# Altium project PCB_Project.PrjPCB
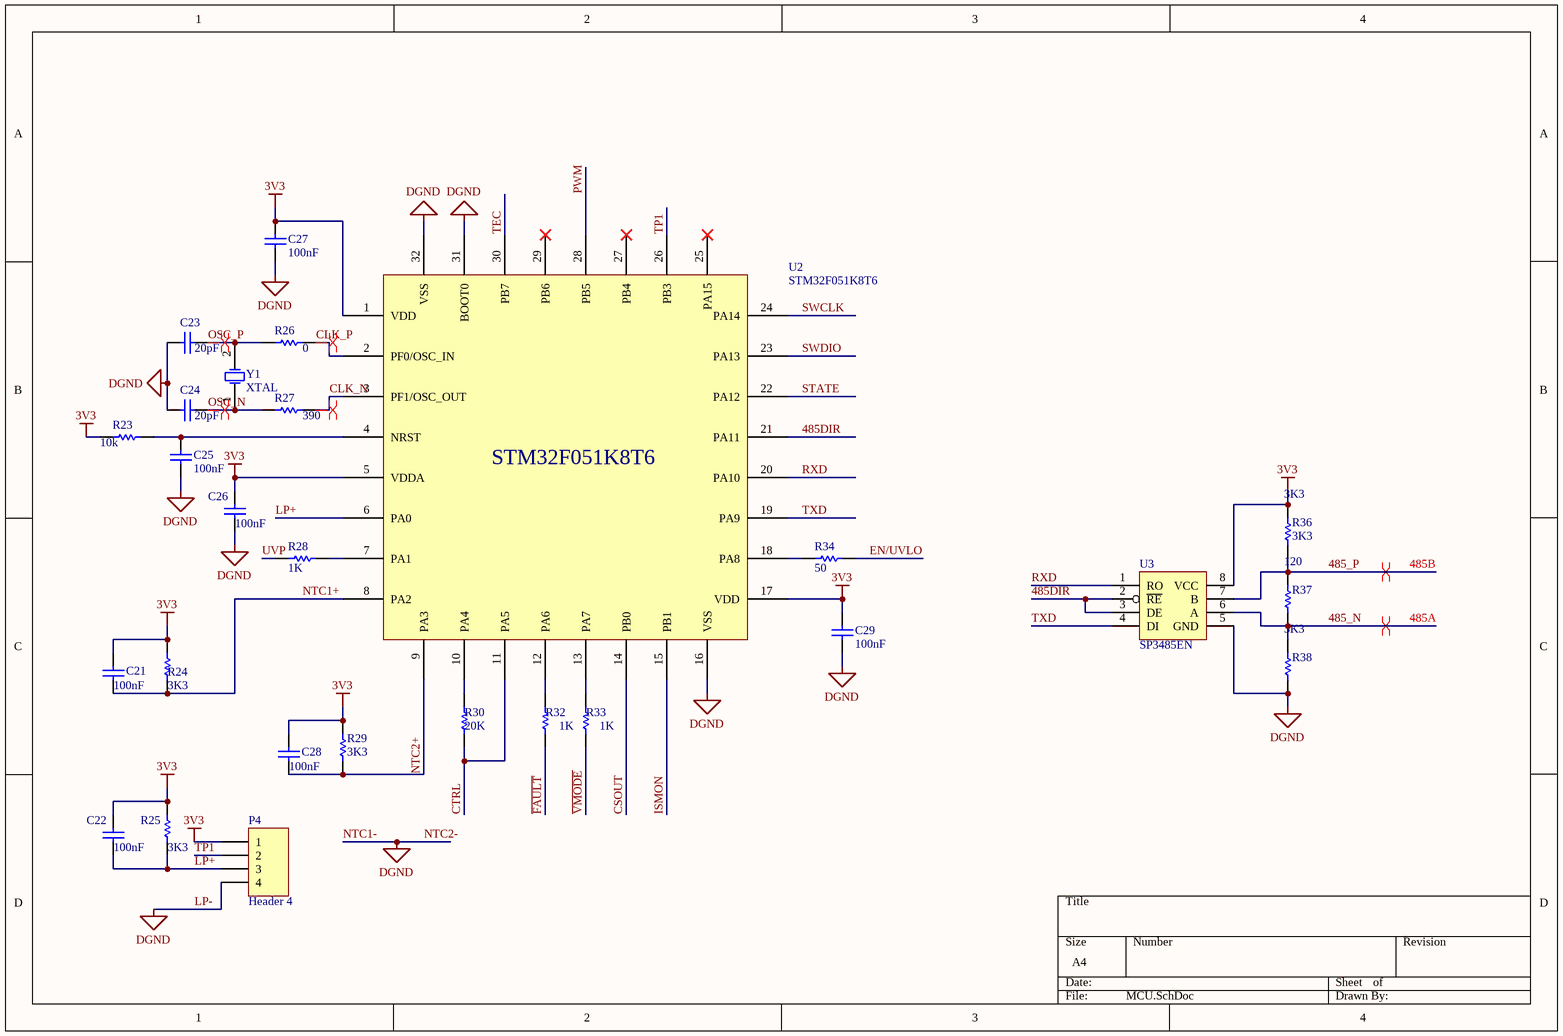
[diagram p0: MCU.SchDoc]
3 sheets, 69 parts. Net scope: global (net labels, ports and power ports of the same name join across sheets).
Board file: 红蓝光PCB.PcbDoc
Sheets:
  MCU.SchDoc
  PWR.SchDoc
  3796.SchDoc

## Sheet MCU.SchDoc
size A4

### Parts
C21  100nF  [1608[0603]]
C22  100nF  [1608[0603]]
C23  20pF  [1608[0603]]
C24  20pF  [1608[0603]]
C25  100nF  [1608[0603]]
C26  100nF  [1608[0603]]
C27  100nF  [1608[0603]]
C28  100nF  [1608[0603]]
C29  100nF  [1608[0603]]
P4  Header 4  [HDR1X4]
R23  10k  [1608[0603]]
R24  3K3  [1608[0603]]
R25  3K3  [1608[0603]]
R26  0  [1608[0603]]
R27  390  [1608[0603]]
R28  1K  [1608[0603]]
R29  3K3  [1608[0603]]
R30  20K  [1608[0603]]
R32  1K  [1608[0603]]
R33  1K  [1608[0603]]
R34  50  [1608[0603]]
R36  3K3  [1608[0603]]
R37  120  [1608[0603]]
R38  3K3  [1608[0603]]
U2  STM32F051K8T6  [TQFP80P900X900X160-32N]
U3  SP3485EN  [SOIC127P600-8N]
Y1  XTAL  [XTAL_SMT]

### Nets
3V3: C21.1 C22.1 C26.1 C27.2 C28.1 C29.2 P4.1 R23.2 R24.1 R25.1 R29.1 R36.2 U2.1(VDD) U2.5(VDDA) U2.17(VDD) U3.8(VCC)
LP-: C23.2 C24.2 C25.1 C26.2 C27.1 C29.1 P4.4 R38.1 U2.16(VSS) U2.31(BOOT0) U2.32(VSS) U3.5(GND)  [also labelled DGND, NTC1-, NTC2-]
485_N: R37.1 R38.2 U3.6(A)  [also labelled 485A]
485_P: R36.1 R37.2 U3.7(B)  [also labelled 485B]
485DIR: U2.21(PA11) U3.2(~{RE}) U3.3(DE)
CLK_N: R27.2 U2.3(PF1/OSC_OUT)
CLK_P: R26.2 U2.2(PF0/OSC_IN)
CSOUT: U2.14(PB0)
CTRL: R30.2 U2.11(PA5)
EN/UVLO: R34.2
~{FAULT}: R32.2
ISMON: U2.15(PB1)
LP+: C22.2 P4.3 R25.2 U2.6(PA0)
NTC1+: C21.2 R24.2 U2.8(PA2)
NTC2+: C28.2 R29.2 U2.9(PA3)
OSC_N: C24.1 R27.1 Y1.1(OSC1)
OSC_P: C23.1 R26.1 Y1.2(OSC2)
PWM: U2.28(PB5)
RXD: U2.20(PA10) U3.1(RO)
STATE: U2.22(PA12)
SWCLK: U2.24(PA14)
SWDIO: U2.23(PA13)
TEC: U2.30(PB7)
TP1: P4.2 U2.26(PB3)
TXD: U2.19(PA9) U3.4(DI)
UVP: R28.1
~{VMODE}: R33.2
NetC25_2: C25.2 R23.1 U2.4(NRST)
NetR28_2: R28.2 U2.7(PA1)
NetR30_1: R30.1 U2.10(PA4)
NetR32_1: R32.1 U2.12(PA6)
NetR33_1: R33.1 U2.13(PA7)
NetR34_1: R34.1 U2.18(PA8)

Not connected (* = marked no-connect by the designer): U2 25(PA15)* 27(PB4)* 29(PB6)*

### Layout directives
differential pair: 485_N, 485_P, CLK_N, CLK_P, OSC_N, OSC_P

### Library data of the parts
C21-C29 = Cap: Capacitor; Published: 8-Jun-2000; LatestRevisionDate: 17-Jul-2002; LatestRevisionNote: Re-released for DXP Platform.; PackageReference: RAD-0.3; Publisher: Altium Limited; PackageDescription: Radial Cap, Thru-Hole; 2 Leads; 0.3 in Pin Spacing
  C21 C22 C25-C29: Value: 100nF
  C23 C24: Value: 20pF
P4 = Header 4: Header, 4-Pin; LatestRevisionDate: 17-Jul-2002; LatestRevisionNote: Re-released for DXP Platform.; Publisher: Altium Limited
R23-R30 R32-R34 R36-R38 = Res1: Resistor; Published: 8-Jun-2000; LatestRevisionDate: 17-Jul-2002; LatestRevisionNote: Re-released for DXP Platform.; PackageReference: AXIAL-0.3; Publisher: Altium Limited; PackageDescription: Axial Device, Thru-Hole; 2 Leads; 0.3 in Pin Spacing
  R23: Value: 10K
  R24 R25 R29 R36 R38: Value: 3K3
  R26: Value: 0
  R27: Value: 390
  R28 R32 R33: Value: 1k
  R30: Value: 20K
  R34: Value: 50
  R37: Value: 120
U2 = MCU_STM32F051K8T6: Low- and medium-density advanced ARM?-based 32-bit MCU with  16 to 64 Kbytes Flash, timers, ADC, DAC and comm. interfaces
U3 = LGC_RS485: Low-Power, Slew-Rate-Limited  RS-485/RS-422 Transceivers
Y1 = XTAL: Crystal Oscillator; Published: 8-Jun-2000; LatestRevisionDate: 17-Jul-2002; LatestRevisionNote: Re-released for DXP Platform.; PackageReference: R38; Publisher: Altium Limited; PackageDescription: Crystal, Thru-Hole; 2 Leads; Body 3.1 x 8.2 mm (Dia.xH)

## Sheet PWR.SchDoc
size A4
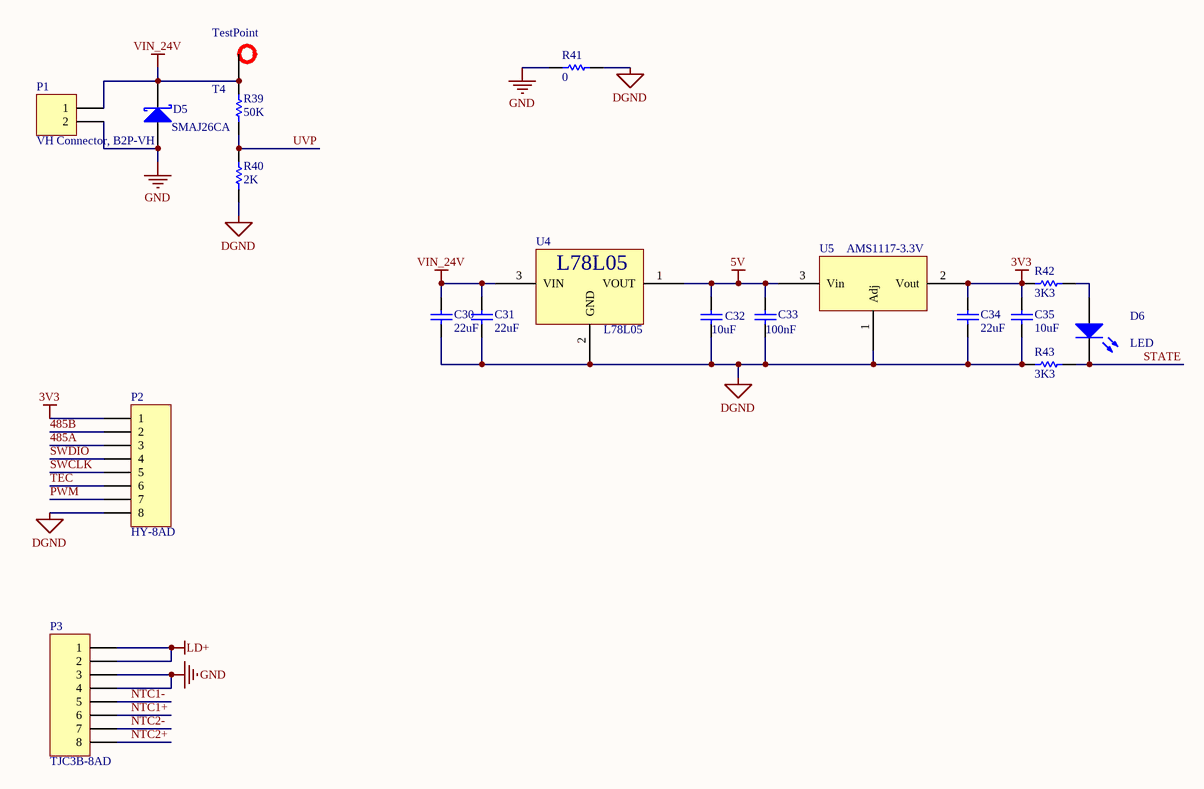
[diagram p1: PWR.SchDoc]

### Parts
C30  22uF  [1608[0603]]
C31  22uF  [1608[0603]]
C32  10uF  [1608[0603]]
C33  100nF  [1608[0603]]
C34  22uF  [1608[0603]]
C35  10uF  [1608[0603]]
D5  SMAJ26CA  [SMA_DIOM5226X26N]
D6  LED  [2012[0805] - LED]
P1  VH Connector, B2P-VH  [2PIN-B2P_VH]
P2  HY-8AD  [8P -HY-8AD]
P3  TJC3B-8AD  [8P-TJC3B8AD]
R39  50K  [1608[0603]]
R40  2K  [1608[0603]]
R41  0  [2012[0805]]
R42  3K3  [1608[0603]]
R43  3K3  [1608[0603]]
T4  Test Point  [TestPoint]  (value not drawn)
U4  L78L05  [SOT89-150P410X160-3N]
U5  AMS1117-3.3V  [SOT89-150P410X160-3N]

### Nets
3V3: C34.2 C35.2 P2.1 R42.2 U5.2(Vout)
5V: C32.2 C33.2 U4.1(VOUT) U5.3(Vin)
DGND: C30.1 C31.1 C32.1 C33.1 C34.1 C35.1 P2.8 P3.5 P3.7 R40.2 R41.1 R43.2 U4.2(GND) U5.1(Adj)  [also labelled NTC1-, NTC2-]  [project net LP-]
GND: D5.1(A) P1.2 P3.3 P3.4 R41.2
LD+: P3.1 P3.2
VIN_24V: C30.2 C31.2 D5.2(K) P1.1 R39.1 T4.1(TP) U4.3(VIN)  [project net CS_P]
485A: P2.3  [project net 485_N]
485B: P2.2  [project net 485_P]
NTC1+: P3.6
NTC2+: P3.8
PWM: P2.7
STATE: D6.2(K) R43.1
SWCLK: P2.5
SWDIO: P2.4
TEC: P2.6
UVP: R39.2 R40.1
NetD6_1: D6.1(A) R42.1

### Notes on the sheet
- (in symbol TP) TestPoint

### Library data of the parts
C30-C35 = Cap: Capacitor; Published: 8-Jun-2000; LatestRevisionDate: 17-Jul-2002; LatestRevisionNote: Re-released for DXP Platform.; PackageReference: RAD-0.3; Publisher: Altium Limited; PackageDescription: Radial Cap, Thru-Hole; 2 Leads; 0.3 in Pin Spacing
  C30 C31 C34: Value: 22uF
  C32 C35: Value: 10uF
  C33: Value: 100nF
D5 = D Schottky: Schottky Diode; Published: 8-Jun-2000; LatestRevisionDate: 17-Jul-2002; LatestRevisionNote: Re-released for DXP Platform.; PackageReference: SMB; Publisher: Altium Limited; PackageDescription: DO-214-AA/SMB; 2 C-Bend Leads; Body 5.3 x 3.6 mm, inc. leads (LxW); Code_JEDEC: DO-214-AA
D6 = LED0: Typical INFRARED GaAs LED; Published: 8-Jun-2000; LatestRevisionDate: 08-Jul-2005; LatestRevisionNote: Mech Layer 1 removed.; PackageReference: LED-0; Publisher: Altium Limited; PackageDescription: LED; 2 Leads
P1 = Header 2: Header, 2-Pin; LatestRevisionDate: 17-Jul-2002; LatestRevisionNote: Re-released for DXP Platform.; Publisher: Altium Limited
P2 P3 = Header 8: Header, 8-Pin; LatestRevisionDate: 17-Jul-2002; LatestRevisionNote: Re-released for DXP Platform.; Publisher: Altium Limited
R39-R43 = Res1: Resistor; Published: 8-Jun-2000; LatestRevisionDate: 17-Jul-2002; LatestRevisionNote: Re-released for DXP Platform.; PackageReference: AXIAL-0.3; Publisher: Altium Limited; PackageDescription: Axial Device, Thru-Hole; 2 Leads; 0.3 in Pin Spacing
  R39: Value: 50k
  R40: Value: 2K
  R41: Value: 0
  R42 R43: Value: 3K3
T4 = TP
U4 = PWR_L78L05: POSITIVE VOLTAGE REGULATORS
U5 = PWR_LM1XXX: 5V转3V3 10mA  DC/DC

## Sheet 3796.SchDoc
size A4
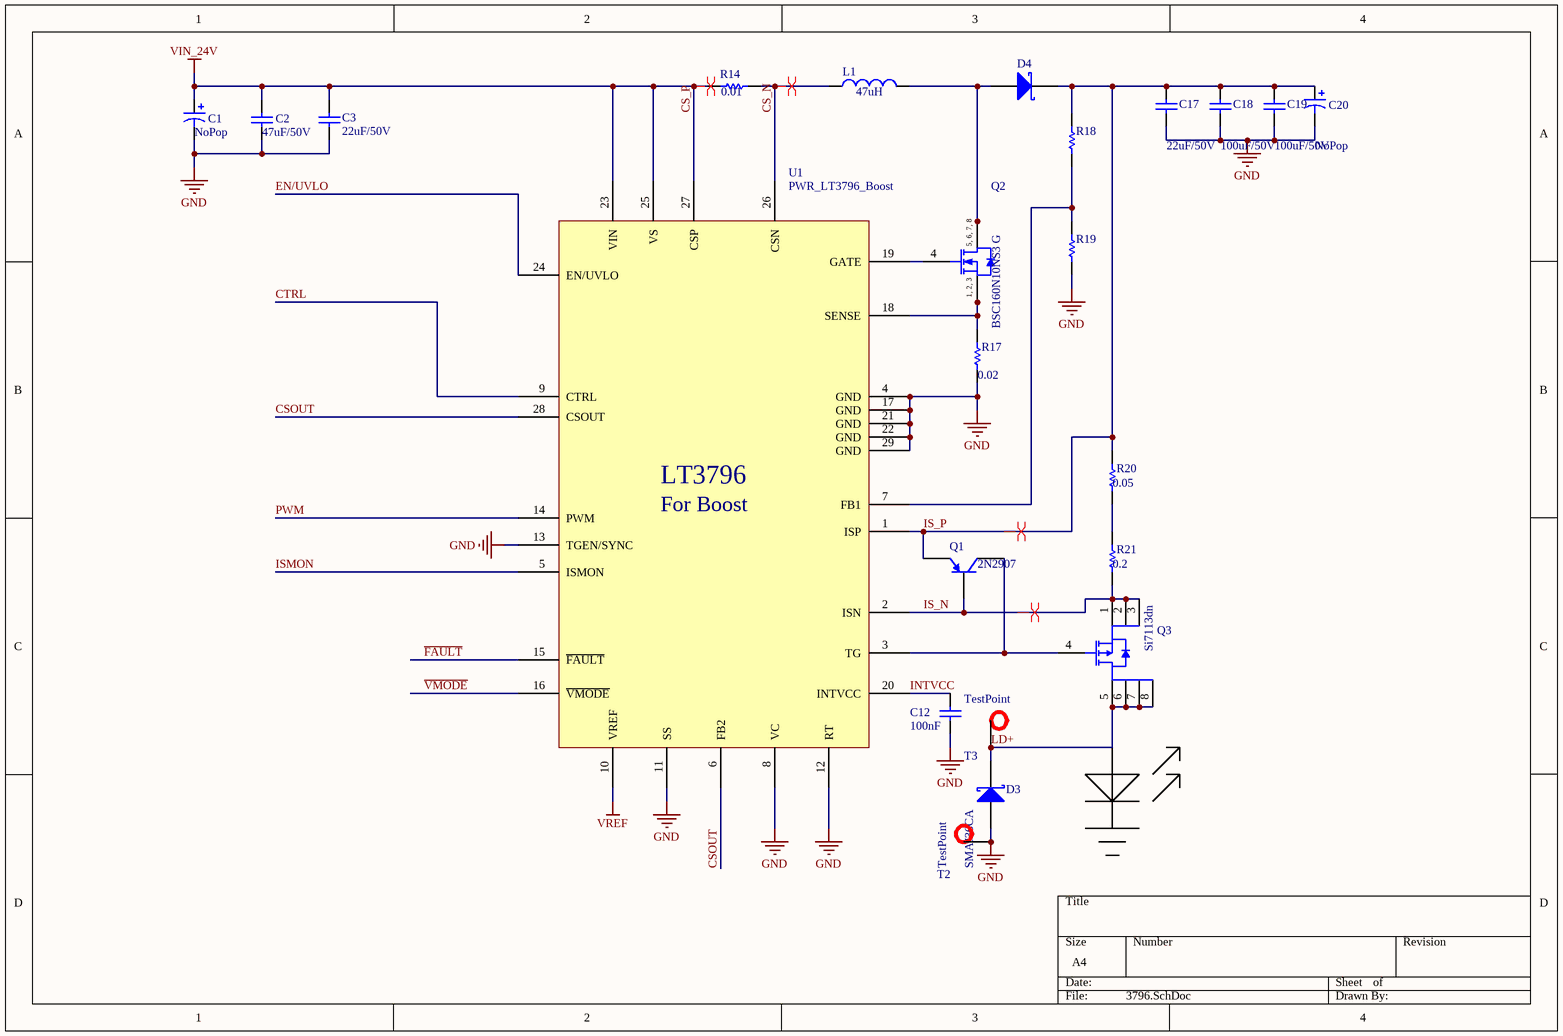
[diagram p2: 3796.SchDoc]

### Parts
C1  NoPop  [SMC_Altium Capacity 8*10]
C2  47uF/50V  [1206[3216] - NP]
C3  22uF/50V  [1206[3216] - NP]
C12  100nF  [1608[0603]]
C17  22uF/50V  [1206[3216] - NP]
C18  100uF/50V  [1206[3216] - NP]
C19  100uF/50V  [1206[3216] - NP]
C20  NoPop  [SMC_Altium Capacity 8*10]
D3  SMAJ36CA  [SMA_DIOM5226X26N]
D4  (no value)  [PowerDI5]
L1  value 47uH  [IHLP4040]  (hidden comment: IHLP-4040DZ-11)
Q1  2N2907  [SOT95P280X115-3N]
Q2  BSC160N10NS3 G  [INF-PG-TDSON-8-1_V]
Q3  Si7113dn  [1212-8 Single]
R14  0.01  [2512[6432]]
R17  0.02  [2512[6432]]
R18  (no value)  [1608[0603]]
R19  (no value)  [1608[0603]]
R20  0.05  [2512[6432]]
R21  0.2  [2512[6432]]
T2  Test Point  [TestPoint]  (value not drawn)
T3  Test Point  [TestPoint]  (value not drawn)
U1  PWR_LT3796_Boost  [TSOP65P640X120_HS-29N]

### Nets
CS_P: C1.1 C2.2 C3.2 R14.1 U1.23(VIN) U1.25(VS) U1.27(CSP)  [also labelled VIN_24V]
GND: C1.2 C2.1 C3.1 C12.2 C17.1 C18.1 C19.1 C20.2 D3.1(A) R17.1 R19.2 T2.1(TP) U1.4(GND) U1.8(VC) U1.11(SS) U1.12(RT) U1.13(TGEN/SYNC) U1.17(GND) U1.21(GND) U1.22(GND) U1.29(GND)
LD+: D3.2(K) Q3.5(DRAIN) Q3.6(DRAIN) Q3.7(DRAIN) Q3.8(DRAIN) T3.1(TP)
VREF: U1.10(VREF)
CS_N: L1.1 R14.2 U1.26(CSN)
CSOUT: U1.6(FB2) U1.28(CSOUT)
CTRL: U1.9(CTRL)
EN/UVLO: U1.24(EN/UVLO)
~{FAULT}: U1.15(~{FAULT})
INTVCC: C12.1 U1.20(INTVCC)
IS_N: Q1.2(B) Q3.1(SOURCE) Q3.2(SOURCE) Q3.3(SOURCE) R21.1 U1.2(ISN)
IS_P: C17.2 C18.2 C19.2 C20.1 D4.2(K) Q1.1(E) R18.2 R20.2 U1.1(ISP)
ISMON: U1.5(ISMON)
PWM: U1.14(PWM)
~{VMODE}: U1.16(~{VMODE})
NetD4_1: D4.1(A) L1.2 Q2.5(DRAIN) Q2.6(DRAIN) Q2.7(DRAIN) Q2.8(DRAIN)
NetQ1_3: Q1.3(C) Q3.4(GATE) U1.3(TG)
NetQ2_1: Q2.1(SOURCE) Q2.2(SOURCE) Q2.3(SOURCE) R17.2 U1.18(SENSE)
NetQ2_4: Q2.4(GATE) U1.19(GATE)
NetR18_1: R18.1 R19.1 U1.7(FB1)
NetR20_1: R20.1 R21.2

### Layout directives
differential pair: CS_N, CS_P, IS_N, IS_P

### Notes on the sheet
- (in symbol BSC160N10NS3 G) 5, 6, 7, 8; 1, 2, 3
- (in symbol PWR_LT3796_Boost) LT3796; For Boost
- (in symbol TP) TestPoint

### Library data of the parts
C1 C20 = Cap Pol1: Polarized Capacitor (Radial); Value: 100uF/50V; Published: 8-Jun-2000; LatestRevisionDate: 17-Jul-2002; LatestRevisionNote: Re-released for DXP Platform.; PackageReference: RB7.6-15; Publisher: Altium Limited; PackageDescription: Polarized Capacitor (Radial); 2 Leads
C2 C3 C12 C17-C19 = Cap: Capacitor; Published: 8-Jun-2000; LatestRevisionDate: 17-Jul-2002; LatestRevisionNote: Re-released for DXP Platform.; PackageReference: RAD-0.3; Publisher: Altium Limited; PackageDescription: Radial Cap, Thru-Hole; 2 Leads; 0.3 in Pin Spacing
  C2: Value: 47uF/50V
  C3 C17: Value: 22uF/50V
  C12: Value: 100nF
  C18 C19: Value: 100uF/50V
D3 D4 = D Schottky: Schottky Diode; Published: 8-Jun-2000; LatestRevisionDate: 17-Jul-2002; LatestRevisionNote: Re-released for DXP Platform.; PackageReference: SMB; Publisher: Altium Limited; PackageDescription: DO-214-AA/SMB; 2 C-Bend Leads; Body 5.3 x 3.6 mm, inc. leads (LxW); Code_JEDEC: DO-214-AA
L1 = Inductor: Code_IEC: 1005; Published: 8-Jun-2000; LatestRevisionDate: 29-May-2009; LatestRevisionNote: IPC-7351 Footprint Added.; PackageReference: 0402-A; Publisher: Altium Limited; PackageDescription: Chip Inductor; Code_JEITA: 0402
Q1 = 2N3906: PNP General Purpose Amplifier; Published: 8-Jun-2000; LatestRevisionDate: 15-Jan-2003; LatestRevisionNote: PCB Footprint 'BCY-W3/D4.7' replaced; DatasheetVersion: 1997; PackageVersion: Sep-1998; PackageReference: TO-92A; Publisher: Altium Limited; PackageDescription: TO, Flat Index; 3 In-Line, Axial Leads; Body Dia. 4.5mm; Leads 0.51 x 0.48 mm (max); ComponentLink1Description: Manufacturer Link; ComponentLink1URL: http://www.fairchildsemi.com/; ComponentLink2Description: Datasheet; ComponentLink2URL: http://www.fairchildsemi.com/ds/2N%2F2N3906.pdf
Q2 = BSC160N10NS3 G: N-Channel OptiMOS 3 Power-Transistor, 100 V VDS, 42 A ID, -55 to 150 degC, PG-TDSON-8-1, Reel, Green; Manufacturer: Infineon; Green: TRUE; ID (max): 42 A; IDpuls (max): 168 A; Polarity: N; Ptot (max): 60 W; QG: 19 nC; RDS (on) (max): 16 mOhm; Rth: 2.1 K/W; RthJA (max): 50 K/W; VDS (max): 100 V; VGS(th) (max): 3.5 V; VGS(th) (min): 2 V; DatasheetVersion: Rev. 2.4; PackageReference: PG-TDSON-8-1; PackageDescription: 8-Pin Plastic (Green) Thin Dual Small Outline Non-Leaded Package, 5.15 x 5.9 mm Body, 1.27 mm Pitch; Supplier 1: Digi-Key; Supplier Part Number 1: BSC160N10NS3 GINTR-ND; Supplier 2: Digi-Key; Supplier Part Number 2: BSC160N10NS3 GINCT-ND; Supplier 3: Digi-Key; Supplier Part Number 3: BSC160N10NS3 GINDKR-ND; Supplier 4: Mouser; Supplier Part Number 4: 726-BSC160N10NS3G; Halogen-free: TRUE; Packing: Reel; RthJC (max): 2.1 K/W; Mounting Technology: Surface Mount; PartNumber: BSC160N10NS3 G; ComponentLink1Description: Manufacturer URL; ComponentLink1URL: http://www.infineon.com/; ComponentLink2Description: Datasheet; ComponentLink2URL: http://www.infineon.com/dgdl/BSC160N10NS3+Rev2.4.pdf?folderId=db3a304313b8b5a60113cee8763b02d7&fileId=db3a30432239cccd01226040189a7f47; ComponentLink3Description: Package Specification; ComponentLink3URL: http://www.infineon.com/cms/packages/SMD_-_Surface_Mounted_Devices/P-PG-TDSON/P-PG-TDSON-08-01x_2x_3.html?__locale=en
Q3 = PWR_ Si7113dn: PMOS, Si7113dn; Manufacturer: Infineon; PartNumber: BSC160N10NS3 G; Green: TRUE; ID (max): 42 A; IDpuls (max): 168 A; Packing: Reel; Polarity: N; Ptot (max): 60 W; QG: 19 nC; RDS (on) (max): 16 mOhm; Rth: 2.1 K/W; RthJA (max): 50 K/W; VDS (max): 100 V; VGS(th) (max): 3.5 V; VGS(th) (min): 2 V; DatasheetVersion: Rev. 2.4; PackageReference: PG-TDSON-8-1; PackageDescription: 8-Pin Plastic (Green) Thin Dual Small Outline Non-Leaded Package, 5.15 x 5.9 mm Body, 1.27 mm Pitch; Supplier 1: Digi-Key; Supplier Part Number 1: BSC160N10NS3 GINTR-ND; Supplier 2: Digi-Key; Supplier Part Number 2: BSC160N10NS3 GINCT-ND; Supplier 3: Digi-Key; Supplier Part Number 3: BSC160N10NS3 GINDKR-ND; Supplier 4: Mouser; Supplier Part Number 4: 726-BSC160N10NS3G; Halogen-free: TRUE; RthJC (max): 2.1 K/W; Mounting Technology: Surface Mount; ComponentLink1Description: Manufacturer URL; ComponentLink1URL: http://www.infineon.com/; ComponentLink2Description: Datasheet; ComponentLink2URL: http://www.infineon.com/dgdl/BSC160N10NS3+Rev2.4.pdf?folderId=db3a304313b8b5a60113cee8763b02d7&fileId=db3a30432239cccd01226040189a7f47; ComponentLink3Description: Package Specification; ComponentLink3URL: http://www.infineon.com/cms/packages/SMD_-_Surface_Mounted_Devices/P-PG-TDSON/P-PG-TDSON-08-01x_2x_3.html?__locale=en
R14 = Res1: Resistor; Value: 10m; Published: 8-Jun-2000; LatestRevisionDate: 17-Jul-2002; LatestRevisionNote: Re-released for DXP Platform.; PackageReference: AXIAL-0.3; Publisher: Altium Limited; PackageDescription: Axial Device, Thru-Hole; 2 Leads; 0.3 in Pin Spacing
R17 = Res1: Resistor; Value: 20m; Published: 8-Jun-2000; LatestRevisionDate: 17-Jul-2002; LatestRevisionNote: Re-released for DXP Platform.; PackageReference: AXIAL-0.3; Publisher: Altium Limited; PackageDescription: Axial Device, Thru-Hole; 2 Leads; 0.3 in Pin Spacing
R18 = Res1: Resistor; Value: 620K; Published: 8-Jun-2000; LatestRevisionDate: 17-Jul-2002; LatestRevisionNote: Re-released for DXP Platform.; PackageReference: AXIAL-0.3; Publisher: Altium Limited; PackageDescription: Axial Device, Thru-Hole; 2 Leads; 0.3 in Pin Spacing
R19 = Res1: Resistor; Value: 20K; Published: 8-Jun-2000; LatestRevisionDate: 17-Jul-2002; LatestRevisionNote: Re-released for DXP Platform.; PackageReference: AXIAL-0.3; Publisher: Altium Limited; PackageDescription: Axial Device, Thru-Hole; 2 Leads; 0.3 in Pin Spacing
R20 = Res1: Resistor; Value: 50m; Published: 8-Jun-2000; LatestRevisionDate: 17-Jul-2002; LatestRevisionNote: Re-released for DXP Platform.; PackageReference: AXIAL-0.3; Publisher: Altium Limited; PackageDescription: Axial Device, Thru-Hole; 2 Leads; 0.3 in Pin Spacing
R21 = Res1: Resistor; Value: 200m; Published: 8-Jun-2000; LatestRevisionDate: 17-Jul-2002; LatestRevisionNote: Re-released for DXP Platform.; PackageReference: AXIAL-0.3; Publisher: Altium Limited; PackageDescription: Axial Device, Thru-Hole; 2 Leads; 0.3 in Pin Spacing
T2 T3 = TP
U1 = PWR_LT3796_Boost: 100V Constant-Current and   Constant-Voltage Controller   with Dual Current Sense

## Nets that join several sheets
3V3: MCU (16 pins), PWR (5 pins)
CS_P: PWR (7 pins), 3796 (7 pins)
GND: PWR (5 pins), 3796 (21 pins)
LD+: PWR (P3.1 P3.2), 3796 (6 pins)
LP-: MCU (12 pins), PWR (14 pins)
485_N: MCU (R37.1 R38.2 U3.6), PWR (P2.3)
485_P: MCU (R36.1 R37.2 U3.7), PWR (P2.2)
CSOUT: MCU (U2.14), 3796 (U1.6 U1.28)
CTRL: MCU (R30.2 U2.11), 3796 (U1.9)
EN/UVLO: MCU (R34.2), 3796 (U1.24)
~{FAULT}: MCU (R32.2), 3796 (U1.15)
ISMON: MCU (U2.15), 3796 (U1.5)
NTC1+: MCU (C21.2 R24.2 U2.8), PWR (P3.6)
NTC2+: MCU (C28.2 R29.2 U2.9), PWR (P3.8)
PWM: MCU (U2.28), PWR (P2.7), 3796 (U1.14)
STATE: MCU (U2.22), PWR (D6.2 R43.1)
SWCLK: MCU (U2.24), PWR (P2.5)
SWDIO: MCU (U2.23), PWR (P2.4)
TEC: MCU (U2.30), PWR (P2.6)
UVP: MCU (R28.1), PWR (R39.2 R40.1)
~{VMODE}: MCU (R33.2), 3796 (U1.16)